# EasyEDA schematic SCH_open_temperature_sensor_2023-12-14.json
TITLE: Open Temperature Sensor; REV: 1.0; Date: 2023-11-14; Sheet: 1/1; Drawn By: stalko; Company: Stalko
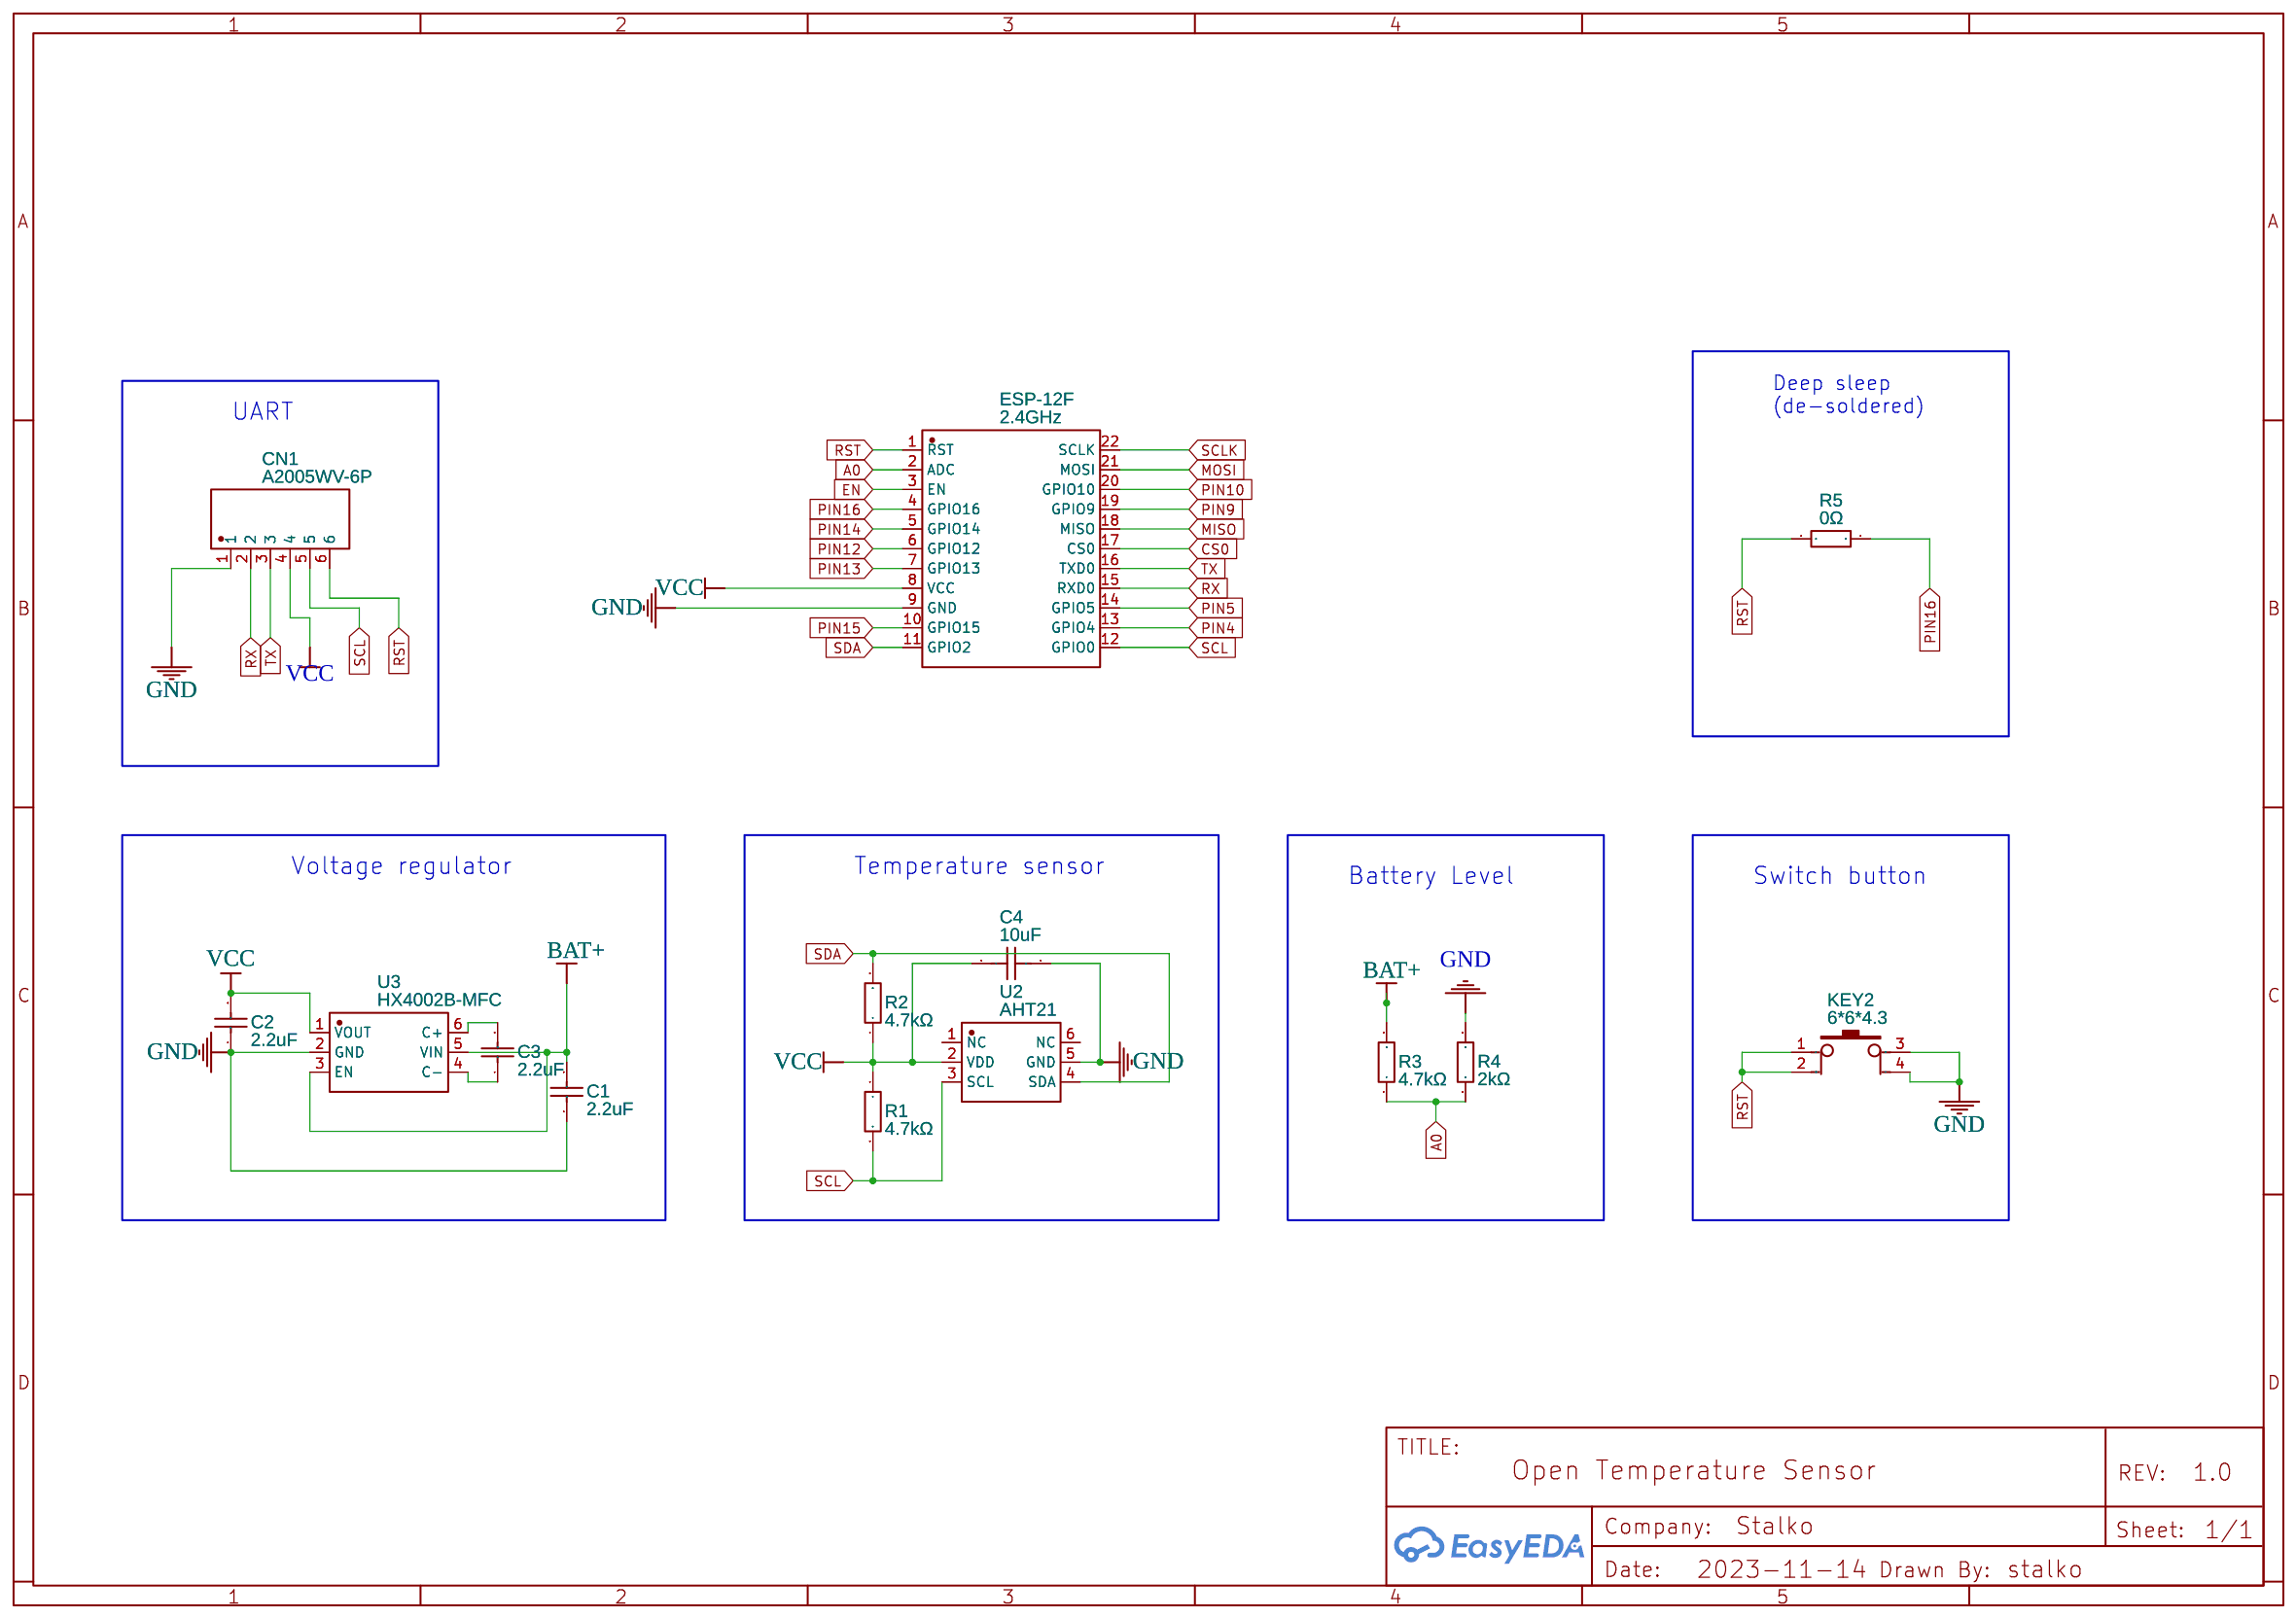
[diagram p0: schematic sheet]

## Parts
C1  2.2uF  [C0805]
C2  2.2uF  [C0805]
C3  2.2uF  [C0805]
C4  10uF  [C0805]
CN1  A2005WV-6P  [HDR-TH_6P-P2.00-V-M]
ESP-12F  2.4GHz  [WIFIM-SMD_ESP-12F-ESP8266MOD]
KEY2  6*6*4.3  [KEY-SMD_4P-L6.0-W6.0-P4.50]
R1  4.7kΩ  [R0805]
R2  4.7kΩ  [R0805]
R3  4.7kΩ  [R0805]
R4  2kΩ  [R0805]
R5  0Ω  [R0805]
U2  AHT21  [SENSOR-SMD_L3.0-W3.0-P1.00-BR]
U3  HX4002B-MFC  [SOT-23-6_L2.9-W1.6-P0.95-LS2.8-BL]

## Library data of the parts
C1-C3 = CC0805ZKY5V8BB225: Supplier: LCSC; Manufacturer: YAGEO(国巨); Supplier Part: C94573; JLCPCB Part Class: Extended Part; link: https://lcsc.com/eda_search?q=C94573&%26type=1&ref=editor
C4 = CC0805KKX7R7BB106: Contributor: LCSC; Supplier: LCSC; Supplier Part: C326595; Manufacturer: YAGEO(国巨); JLCPCB Part Class: Extended Part; link: https://lcsc.com/eda_search?q=C326595&%26type=1&ref=editor
CN1 = A2005WV-6P: Contributor: LCSC; Supplier: LCSC; Supplier Part: C225258; Manufacturer: CJT(长江连接器); JLCPCB Part Class: Extended Part; link: https://lcsc.com/eda_search?q=C225258&%26type=1&ref=editor
ESP-12F = ESP-12F(ESP8266MOD): Supplier: LCSC; Manufacturer: Ai-Thinker(安信可); Supplier Part: C82891; JLCPCB Part Class: Extended Part; link: https://lcsc.com/eda_search?q=C82891&%26type=1&ref=editor
KEY2 = 6*6*4.3: Supplier: LCSC; Manufacturer: ReliaPro; Supplier Part: C46502; link: https://lcsc.com/eda_search?q=C46502&%26type=1&ref=editor
R1-R3 R5 = RMC08054.7K5%N: Contributor: LCSC; Supplier: LCSC; Supplier Part: C269733; Manufacturer: Tyohm(幸亚电阻); JLCPCB Part Class: Extended Part; link: https://lcsc.com/eda_search?q=C269733&%26type=1&ref=editor
R4 = CR0805F82371G: Supplier: LCSC; Manufacturer: LIZ(丽智电子); Supplier Part: C101583; JLCPCB Part Class: Extended Part; link: https://lcsc.com/eda_search?q=C101583&%26type=1&ref=editor
U2 = AHT21: Contributor: LCSC; Supplier: LCSC; Supplier Part: C2827328; Manufacturer: 广州奥松; JLCPCB Part Class: Extended Part; link: https://lcsc.com/eda_search?q=C2827328&%26type=1&ref=editor
U3 = HX4002B-MFC: Contributor: lcsc; Supplier: LCSC; Supplier Part: C9900010804; Manufacturer: null; JLCPCB Part Class: Extended Part; link: https://lcsc.com/eda_search?q=C9900010804&%26type=1&ref=editor

## Nets
GND: C1.1 C2.1 C4.1 CN1.1 ESP-12F.9(GND) KEY2.3 KEY2.4 R4.2 U2.5(GND) U3.2(GND)
VCC: C2.2 C4.2 CN1.4 ESP-12F.8(VCC) R1.1 R2.1 U2.2(VDD) U3.1(VOUT)
A0: ESP-12F.2(ADC) R3.1 R4.1
BAT+: C1.2 R3.2 U3.3(EN) U3.5(VIN)
CS0: ESP-12F.17(CS0)
EN: ESP-12F.3(EN)
MISO: ESP-12F.18(MISO)
MOSI: ESP-12F.21(MOSI)
PIN4: ESP-12F.13(GPIO4)
PIN5: ESP-12F.14(GPIO5)
PIN9: ESP-12F.19(GPIO9)
PIN10: ESP-12F.20(GPIO10)
PIN12: ESP-12F.6(GPIO12)
PIN13: ESP-12F.7(GPIO13)
PIN14: ESP-12F.5(GPIO14)
PIN15: ESP-12F.10(GPIO15)
PIN16: ESP-12F.4(GPIO16) R5.1
RST: CN1.6 ESP-12F.1(RST) KEY2.1 KEY2.2 R5.2
RX: CN1.2 ESP-12F.15(RXD0)
SCL: CN1.5 ESP-12F.12(GPIO0) R1.2 U2.3(SCL)
SCLK: ESP-12F.22(SCLK)
SDA: ESP-12F.11(GPIO2) R2.2 U2.4(SDA)
TX: CN1.3 ESP-12F.16(TXD0)
Net-(C3-1): C3.1 U3.4(C-)
Net-(C3-2): C3.2 U3.6(C+)

Not connected (* = marked no-connect by the designer): U2 1(NC) 6(NC)

## Notes on the sheet
- Deep sleep
  (de-soldered)
- UART
- Voltage regulator
- Temperature sensor
- Battery Level
- Switch button
